# Altium schematic sheet ledcube8x8x8.SchDoc
size A3
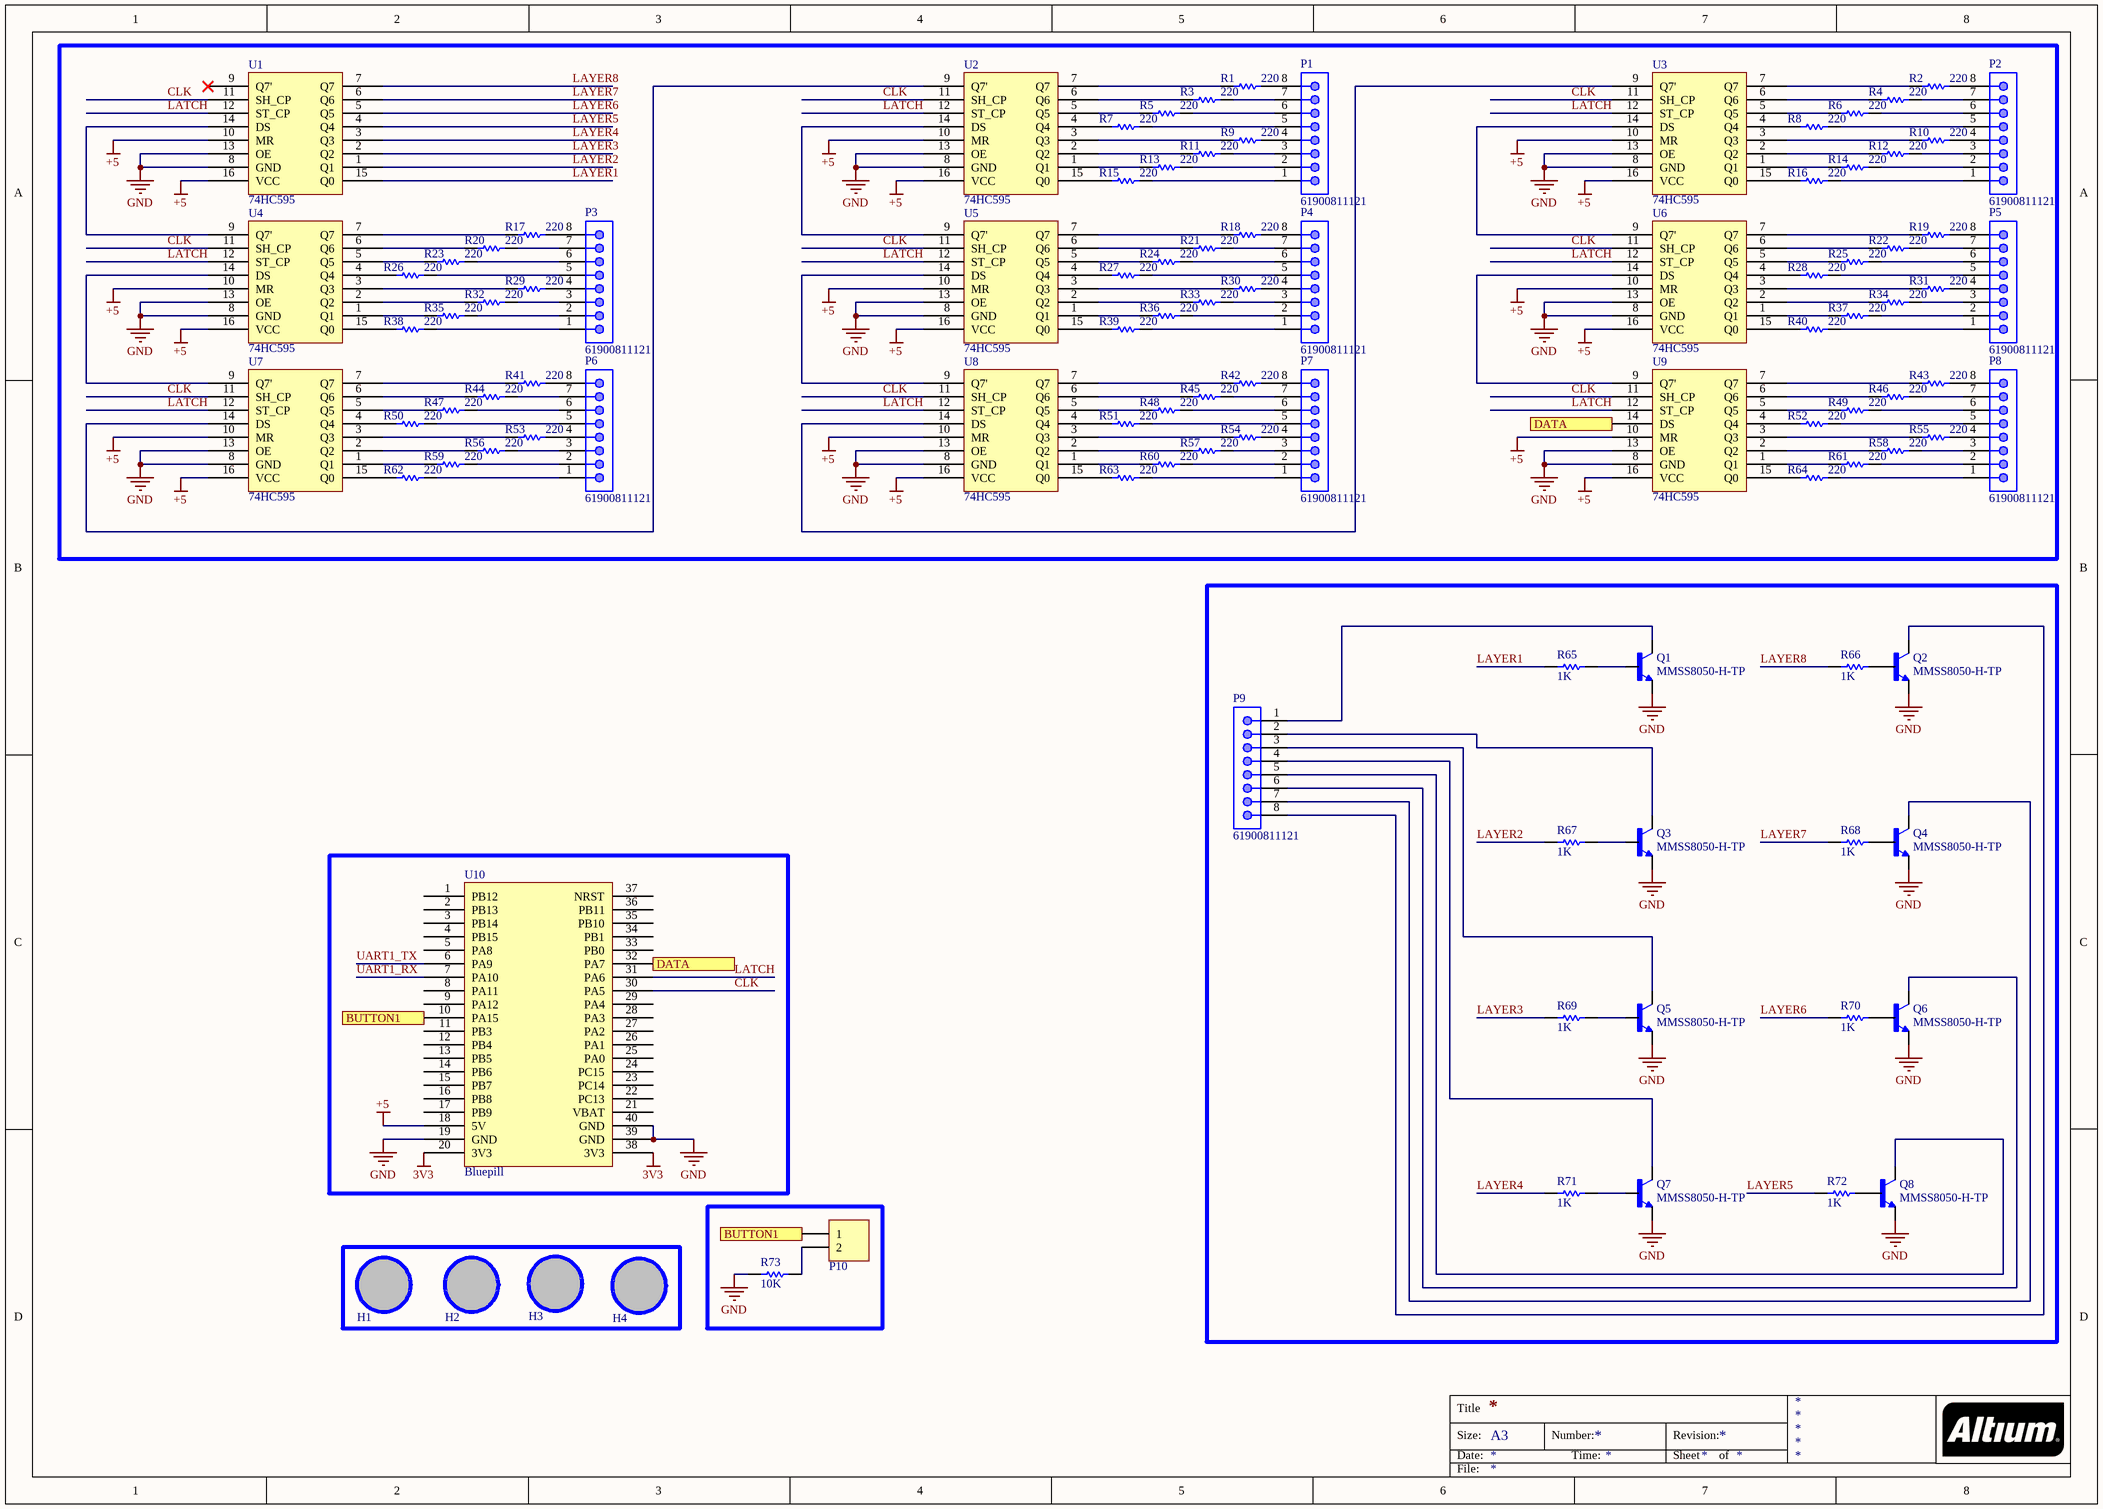
[diagram p0: ledcube8x8x8.SchDoc]

## Parts
H1  Hole  [LO KHOAN 3MM]  (value not drawn)
H2  Hole  [LO KHOAN 3MM]  (value not drawn)
H3  Hole  [LO KHOAN 3MM]  (value not drawn)
H4  Hole  [LO KHOAN 3MM]  (value not drawn)
P1  61900811121  [61900811121]
P2  61900811121  [61900811121]
P3  61900811121  [61900811121]
P4  61900811121  [61900811121]
P5  61900811121  [61900811121]
P6  61900811121  [61900811121]
P7  61900811121  [61900811121]
P8  61900811121  [61900811121]
P9  61900811121  [61900811121]
P10  Domino 2  [DOMINO SMALL 2]  (value not drawn)
Q1  MMSS8050-H-TP  [TRANS_MMSS8050-H-TP]
Q2  MMSS8050-H-TP  [TRANS_MMSS8050-H-TP]
Q3  MMSS8050-H-TP  [TRANS_MMSS8050-H-TP]
Q4  MMSS8050-H-TP  [TRANS_MMSS8050-H-TP]
Q5  MMSS8050-H-TP  [TRANS_MMSS8050-H-TP]
Q6  MMSS8050-H-TP  [TRANS_MMSS8050-H-TP]
Q7  MMSS8050-H-TP  [TRANS_MMSS8050-H-TP]
Q8  MMSS8050-H-TP  [TRANS_MMSS8050-H-TP]
R1  value 220  [RES-SM-0603]  (hidden comment: RESISTOR SMD)
R2  value 220  [RES-SM-0603]  (hidden comment: RESISTOR SMD)
R3  value 220  [RES-SM-0603]  (hidden comment: RESISTOR SMD)
R4  value 220  [RES-SM-0603]  (hidden comment: RESISTOR SMD)
R5  value 220  [RES-SM-0603]  (hidden comment: RESISTOR SMD)
R6  value 220  [RES-SM-0603]  (hidden comment: RESISTOR SMD)
R7  value 220  [RES-SM-0603]  (hidden comment: RESISTOR SMD)
R8  value 220  [RES-SM-0603]  (hidden comment: RESISTOR SMD)
R9  value 220  [RES-SM-0603]  (hidden comment: RESISTOR SMD)
R10  value 220  [RES-SM-0603]  (hidden comment: RESISTOR SMD)
R11  value 220  [RES-SM-0603]  (hidden comment: RESISTOR SMD)
R12  value 220  [RES-SM-0603]  (hidden comment: RESISTOR SMD)
R13  value 220  [RES-SM-0603]  (hidden comment: RESISTOR SMD)
R14  value 220  [RES-SM-0603]  (hidden comment: RESISTOR SMD)
R15  value 220  [RES-SM-0603]  (hidden comment: RESISTOR SMD)
R16  value 220  [RES-SM-0603]  (hidden comment: RESISTOR SMD)
R17  value 220  [RES-SM-0603]  (hidden comment: RESISTOR SMD)
R18  value 220  [RES-SM-0603]  (hidden comment: RESISTOR SMD)
R19  value 220  [RES-SM-0603]  (hidden comment: RESISTOR SMD)
R20  value 220  [RES-SM-0603]  (hidden comment: RESISTOR SMD)
R21  value 220  [RES-SM-0603]  (hidden comment: RESISTOR SMD)
R22  value 220  [RES-SM-0603]  (hidden comment: RESISTOR SMD)
R23  value 220  [RES-SM-0603]  (hidden comment: RESISTOR SMD)
R24  value 220  [RES-SM-0603]  (hidden comment: RESISTOR SMD)
R25  value 220  [RES-SM-0603]  (hidden comment: RESISTOR SMD)
R26  value 220  [RES-SM-0603]  (hidden comment: RESISTOR SMD)
R27  value 220  [RES-SM-0603]  (hidden comment: RESISTOR SMD)
R28  value 220  [RES-SM-0603]  (hidden comment: RESISTOR SMD)
R29  value 220  [RES-SM-0603]  (hidden comment: RESISTOR SMD)
R30  value 220  [RES-SM-0603]  (hidden comment: RESISTOR SMD)
R31  value 220  [RES-SM-0603]  (hidden comment: RESISTOR SMD)
R32  value 220  [RES-SM-0603]  (hidden comment: RESISTOR SMD)
R33  value 220  [RES-SM-0603]  (hidden comment: RESISTOR SMD)
R34  value 220  [RES-SM-0603]  (hidden comment: RESISTOR SMD)
R35  value 220  [RES-SM-0603]  (hidden comment: RESISTOR SMD)
R36  value 220  [RES-SM-0603]  (hidden comment: RESISTOR SMD)
R37  value 220  [RES-SM-0603]  (hidden comment: RESISTOR SMD)
R38  value 220  [RES-SM-0603]  (hidden comment: RESISTOR SMD)
R39  value 220  [RES-SM-0603]  (hidden comment: RESISTOR SMD)
R40  value 220  [RES-SM-0603]  (hidden comment: RESISTOR SMD)
R41  value 220  [RES-SM-0603]  (hidden comment: RESISTOR SMD)
R42  value 220  [RES-SM-0603]  (hidden comment: RESISTOR SMD)
R43  value 220  [RES-SM-0603]  (hidden comment: RESISTOR SMD)
R44  value 220  [RES-SM-0603]  (hidden comment: RESISTOR SMD)
R45  value 220  [RES-SM-0603]  (hidden comment: RESISTOR SMD)
R46  value 220  [RES-SM-0603]  (hidden comment: RESISTOR SMD)
R47  value 220  [RES-SM-0603]  (hidden comment: RESISTOR SMD)
R48  value 220  [RES-SM-0603]  (hidden comment: RESISTOR SMD)
R49  value 220  [RES-SM-0603]  (hidden comment: RESISTOR SMD)
R50  value 220  [RES-SM-0603]  (hidden comment: RESISTOR SMD)
R51  value 220  [RES-SM-0603]  (hidden comment: RESISTOR SMD)
R52  value 220  [RES-SM-0603]  (hidden comment: RESISTOR SMD)
R53  value 220  [RES-SM-0603]  (hidden comment: RESISTOR SMD)
R54  value 220  [RES-SM-0603]  (hidden comment: RESISTOR SMD)
R55  value 220  [RES-SM-0603]  (hidden comment: RESISTOR SMD)
R56  value 220  [RES-SM-0603]  (hidden comment: RESISTOR SMD)
R57  value 220  [RES-SM-0603]  (hidden comment: RESISTOR SMD)
R58  value 220  [RES-SM-0603]  (hidden comment: RESISTOR SMD)
R59  value 220  [RES-SM-0603]  (hidden comment: RESISTOR SMD)
R60  value 220  [RES-SM-0603]  (hidden comment: RESISTOR SMD)
R61  value 220  [RES-SM-0603]  (hidden comment: RESISTOR SMD)
R62  value 220  [RES-SM-0603]  (hidden comment: RESISTOR SMD)
R63  value 220  [RES-SM-0603]  (hidden comment: RESISTOR SMD)
R64  value 220  [RES-SM-0603]  (hidden comment: RESISTOR SMD)
R65  value 1K  [RES-SM-0603]  (hidden comment: RESISTOR SMD)
R66  value 1K  [RES-SM-0603]  (hidden comment: RESISTOR SMD)
R67  value 1K  [RES-SM-0603]  (hidden comment: RESISTOR SMD)
R68  value 1K  [RES-SM-0603]  (hidden comment: RESISTOR SMD)
R69  value 1K  [RES-SM-0603]  (hidden comment: RESISTOR SMD)
R70  value 1K  [RES-SM-0603]  (hidden comment: RESISTOR SMD)
R71  value 1K  [RES-SM-0603]  (hidden comment: RESISTOR SMD)
R72  value 1K  [RES-SM-0603]  (hidden comment: RESISTOR SMD)
R73  value 10K  [RES-SM-0603]  (hidden comment: RESISTOR SMD)
U1  74HC595  [74HC595D]
U2  74HC595  [74HC595D]
U3  74HC595  [74HC595D]
U4  74HC595  [74HC595D]
U5  74HC595  [74HC595D]
U6  74HC595  [74HC595D]
U7  74HC595  [74HC595D]
U8  74HC595  [74HC595D]
U9  74HC595  [74HC595D]
U10  Bluepill  [BLUEPILL]

## Ports
BUTTON1 (in), BUTTON1 (out), DATA (in), DATA (out)

## Nets
3V3: U10.20(3V3) U10.38(3V3)
+5: U1.10(MR) U1.16(VCC) U2.10(MR) U2.16(VCC) U3.10(MR) U3.16(VCC) U4.10(MR) U4.16(VCC) U5.10(MR) U5.16(VCC) U6.10(MR) U6.16(VCC) U7.10(MR) U7.16(VCC) U8.10(MR) U8.16(VCC) U9.10(MR) U9.16(VCC) U10.18(5V)
GND: Q1.2(E) Q2.2(E) Q3.2(E) Q4.2(E) Q5.2(E) Q6.2(E) Q7.2(E) Q8.2(E) R73.1 U1.8(GND) U1.13(OE) U2.8(GND) U2.13(OE) U3.8(GND) U3.13(OE) U4.8(GND) U4.13(OE) U5.8(GND) U5.13(OE) U6.8(GND) U6.13(OE) U7.8(GND) U7.13(OE) U8.8(GND) U8.13(OE) U9.8(GND) U9.13(OE) U10.19(GND) U10.39(GND) U10.40(GND)
BUTTON1: P10.1 U10.10(PA15) ; port BUTTON1
CLK: U1.11(SH_CP) U2.11(SH_CP) U3.11(SH_CP) U4.11(SH_CP) U5.11(SH_CP) U6.11(SH_CP) U7.11(SH_CP) U8.11(SH_CP) U9.11(SH_CP) U10.30(PA5)
DATA: U9.14(DS) U10.32(PA7) ; port DATA
LATCH: U1.12(ST_CP) U2.12(ST_CP) U3.12(ST_CP) U4.12(ST_CP) U5.12(ST_CP) U6.12(ST_CP) U7.12(ST_CP) U8.12(ST_CP) U9.12(ST_CP) U10.31(PA6)
LAYER1: R65.1 U1.15(Q0)
LAYER2: R67.1 U1.1(Q1)
LAYER3: R69.1 U1.2(Q2)
LAYER4: R71.1 U1.3(Q3)
LAYER5: R72.1 U1.4(Q4)
LAYER6: R70.1 U1.5(Q5)
LAYER7: R68.1 U1.6(Q6)
LAYER8: R66.1 U1.7(Q7)
UART1_RX: U10.7(PA10)
UART1_TX: U10.6(PA9)
NetP1_1: P1.1 R15.1
NetP1_2: P1.2 R13.1
NetP1_3: P1.3 R11.1
NetP1_4: P1.4 R9.1
NetP1_5: P1.5 R7.1
NetP1_6: P1.6 R5.1
NetP1_7: P1.7 R3.1
NetP1_8: P1.8 R1.1
NetP2_1: P2.1 R16.1
NetP2_2: P2.2 R14.1
NetP2_3: P2.3 R12.1
NetP2_4: P2.4 R10.1
NetP2_5: P2.5 R8.1
NetP2_6: P2.6 R6.1
NetP2_7: P2.7 R4.1
NetP2_8: P2.8 R2.1
NetP3_1: P3.1 R38.1
NetP3_2: P3.2 R35.1
NetP3_3: P3.3 R32.1
NetP3_4: P3.4 R29.1
NetP3_5: P3.5 R26.1
NetP3_6: P3.6 R23.1
NetP3_7: P3.7 R20.1
NetP3_8: P3.8 R17.1
NetP4_1: P4.1 R39.1
NetP4_2: P4.2 R36.1
NetP4_3: P4.3 R33.1
NetP4_4: P4.4 R30.1
NetP4_5: P4.5 R27.1
NetP4_6: P4.6 R24.1
NetP4_7: P4.7 R21.1
NetP4_8: P4.8 R18.1
NetP5_1: P5.1 R40.1
NetP5_2: P5.2 R37.1
NetP5_3: P5.3 R34.1
NetP5_4: P5.4 R31.1
NetP5_5: P5.5 R28.1
NetP5_6: P5.6 R25.1
NetP5_7: P5.7 R22.1
NetP5_8: P5.8 R19.1
NetP6_1: P6.1 R62.1
NetP6_2: P6.2 R59.1
NetP6_3: P6.3 R56.1
NetP6_4: P6.4 R53.1
NetP6_5: P6.5 R50.1
NetP6_6: P6.6 R47.1
NetP6_7: P6.7 R44.1
NetP6_8: P6.8 R41.1
NetP7_1: P7.1 R63.1
NetP7_2: P7.2 R60.1
NetP7_3: P7.3 R57.1
NetP7_4: P7.4 R54.1
NetP7_5: P7.5 R51.1
NetP7_6: P7.6 R48.1
NetP7_7: P7.7 R45.1
NetP7_8: P7.8 R42.1
NetP8_1: P8.1 R64.1
NetP8_2: P8.2 R61.1
NetP8_3: P8.3 R58.1
NetP8_4: P8.4 R55.1
NetP8_5: P8.5 R52.1
NetP8_6: P8.6 R49.1
NetP8_7: P8.7 R46.1
NetP8_8: P8.8 R43.1
NetP9_1: P9.1 Q1.3(C)
NetP9_2: P9.2 Q3.3(C)
NetP9_3: P9.3 Q5.3(C)
NetP9_4: P9.4 Q7.3(C)
NetP9_5: P9.5 Q8.3(C)
NetP9_6: P9.6 Q6.3(C)
NetP9_7: P9.7 Q4.3(C)
NetP9_8: P9.8 Q2.3(C)
NetP10_2: P10.2 R73.2
NetQ1_1: Q1.1(B) R65.2
NetQ2_1: Q2.1(B) R66.2
NetQ3_1: Q3.1(B) R67.2
NetQ4_1: Q4.1(B) R68.2
NetQ5_1: Q5.1(B) R69.2
NetQ6_1: Q6.1(B) R70.2
NetQ7_1: Q7.1(B) R71.2
NetQ8_1: Q8.1(B) R72.2
NetR1_2: R1.2 U2.7(Q7)
NetR2_2: R2.2 U3.7(Q7)
NetR3_2: R3.2 U2.6(Q6)
NetR4_2: R4.2 U3.6(Q6)
NetR5_2: R5.2 U2.5(Q5)
NetR6_2: R6.2 U3.5(Q5)
NetR7_2: R7.2 U2.4(Q4)
NetR8_2: R8.2 U3.4(Q4)
NetR9_2: R9.2 U2.3(Q3)
NetR10_2: R10.2 U3.3(Q3)
NetR11_2: R11.2 U2.2(Q2)
NetR12_2: R12.2 U3.2(Q2)
NetR13_2: R13.2 U2.1(Q1)
NetR14_2: R14.2 U3.1(Q1)
NetR15_2: R15.2 U2.15(Q0)
NetR16_2: R16.2 U3.15(Q0)
NetR17_2: R17.2 U4.7(Q7)
NetR18_2: R18.2 U5.7(Q7)
NetR19_2: R19.2 U6.7(Q7)
NetR20_2: R20.2 U4.6(Q6)
NetR21_2: R21.2 U5.6(Q6)
NetR22_2: R22.2 U6.6(Q6)
NetR23_2: R23.2 U4.5(Q5)
NetR24_2: R24.2 U5.5(Q5)
NetR25_2: R25.2 U6.5(Q5)
NetR26_2: R26.2 U4.4(Q4)
NetR27_2: R27.2 U5.4(Q4)
NetR28_2: R28.2 U6.4(Q4)
NetR29_2: R29.2 U4.3(Q3)
NetR30_2: R30.2 U5.3(Q3)
NetR31_2: R31.2 U6.3(Q3)
NetR32_2: R32.2 U4.2(Q2)
NetR33_2: R33.2 U5.2(Q2)
NetR34_2: R34.2 U6.2(Q2)
NetR35_2: R35.2 U4.1(Q1)
NetR36_2: R36.2 U5.1(Q1)
NetR37_2: R37.2 U6.1(Q1)
NetR38_2: R38.2 U4.15(Q0)
NetR39_2: R39.2 U5.15(Q0)
NetR40_2: R40.2 U6.15(Q0)
NetR41_2: R41.2 U7.7(Q7)
NetR42_2: R42.2 U8.7(Q7)
NetR43_2: R43.2 U9.7(Q7)
NetR44_2: R44.2 U7.6(Q6)
NetR45_2: R45.2 U8.6(Q6)
NetR46_2: R46.2 U9.6(Q6)
NetR47_2: R47.2 U7.5(Q5)
NetR48_2: R48.2 U8.5(Q5)
NetR49_2: R49.2 U9.5(Q5)
NetR50_2: R50.2 U7.4(Q4)
NetR51_2: R51.2 U8.4(Q4)
NetR52_2: R52.2 U9.4(Q4)
NetR53_2: R53.2 U7.3(Q3)
NetR54_2: R54.2 U8.3(Q3)
NetR55_2: R55.2 U9.3(Q3)
NetR56_2: R56.2 U7.2(Q2)
NetR57_2: R57.2 U8.2(Q2)
NetR58_2: R58.2 U9.2(Q2)
NetR59_2: R59.2 U7.1(Q1)
NetR60_2: R60.2 U8.1(Q1)
NetR61_2: R61.2 U9.1(Q1)
NetR62_2: R62.2 U7.15(Q0)
NetR63_2: R63.2 U8.15(Q0)
NetR64_2: R64.2 U9.15(Q0)
NetU1_14: U1.14(DS) U4.9(Q7')
NetU2_9: U2.9(Q7') U7.14(DS)
NetU2_14: U2.14(DS) U5.9(Q7')
NetU3_9: U3.9(Q7') U8.14(DS)
NetU3_14: U3.14(DS) U6.9(Q7')
NetU4_14: U4.14(DS) U7.9(Q7')
NetU5_14: U5.14(DS) U8.9(Q7')
NetU6_14: U6.14(DS) U9.9(Q7')

Not connected (* = marked no-connect by the designer): H1 1; H2 1; H3 1; H4 1; U1 9(Q7')*; U10 1(PB12) 2(PB13) 3(PB14) 4(PB15) 5(PA8) 8(PA11) 9(PA12) 11(PB3) 12(PB4) 13(PB5) 14(PB6) 15(PB7) 16(PB8) 17(PB9) 21(VBAT) 22(PC13) 23(PC14) 24(PC15) 25(PA0) 26(PA1) 27(PA2) 28(PA3) 29(PA4) 33(PB0) 34(PB1) 35(PB10) 36(PB11) 37(NRST)

## Notes on the sheet
- Title
- Size:
- Date:
- A3
- Number:
- Time:
- Revision:
- Sheet
- of
- File:

## Library data of the parts
H1-H4 = Hole: Hole 3mm
P1-P9 = 61900811121: WR-WTB THT Male Vertical Locking Header, pitch 2.54mm, 8p; Pin Number: 8; Contact Resistance: 20mOhm; Rated Current: 3A; Withstanding Voltage: 1000VAC; Working Voltage: 250VAC; ComponentLink1Description: Manufacturer; ComponentLink1URL: http://www.we-online.de; ComponentLink2Description: Datasheet; ComponentLink2URL: https://www.we-online.com/catalog/datasheet/61900811121.pdf; Pitch: 2.54mm; Published Date: January 2020; Publisher: Wurth Elektronik; Mounting Technology: THT; Packaging: Bag; Operating Temperature: -40 to +105degC; Part Number: 61900811121; Gender: Male; Type: Vertical
P10 = Domino 2: Domino, 2-Pin; LatestRevisionDate: 17-Jul-2002; LatestRevisionNote: Re-released for DXP Platform.; Publisher: Altium Limited
Q1-Q8 = MMSS8050-H-TP: Bipolar _BJT_ Transistor NPN 25V 1.5A 100MHz 625mW Surface Mount SOT-23; MF: Micro Commercial; Value: *; Availability: Unavailable; SnapEDA_Link: https://www.snapeda.com/parts/MMSS8050-H-TP/Micro%20Commercial/view-part/423878/?ref=snap; Package: SOT-23 Micro Commercial; MP: MMSS8050-H-TP; Price: None
R1-R73 = RESISTOR SMD: Resistor
U1-U9 = 74HC595D